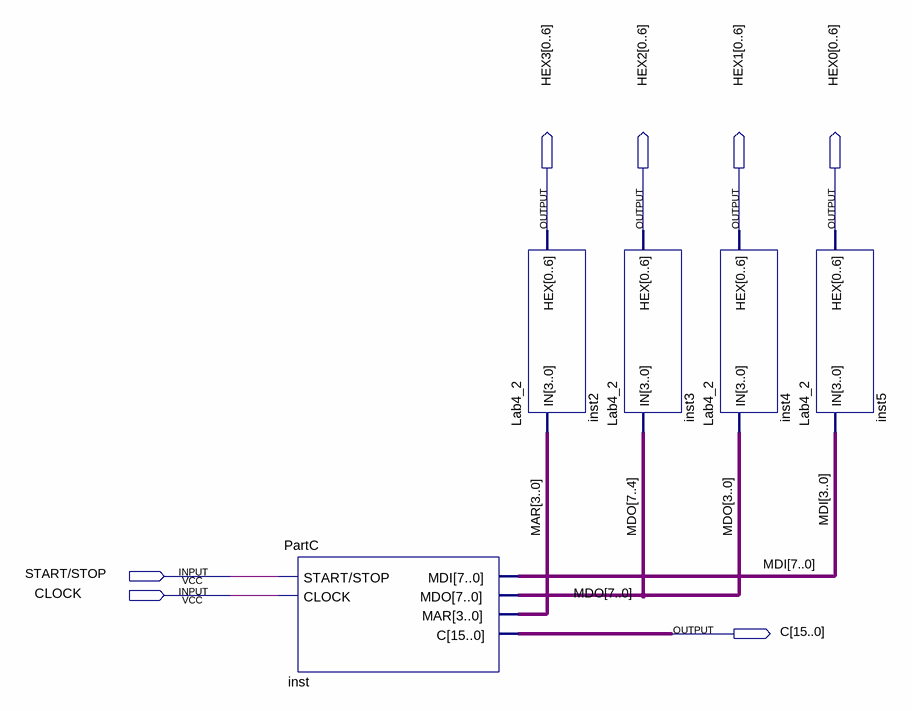
[diagram p0: schematic sheet]
// Quartus schematic TRISC_Pres.bdf as structural Verilog: 5 symbols, 7 pins
module TRISC_Pres (
  input  \START/STOP ,
  input  CLOCK,
  output [0:6] HEX3,
  output [0:6] HEX2,
  output [0:6] HEX1,
  output [0:6] HEX0,
  output [15:0] C
);

  wire [3:0] MAR;
  wire [7:0] MDI, MDO;

  PartC inst (.\START/STOP (\START/STOP ), .CLOCK(CLOCK), .MDI(MDI), .MDO(MDO), .MAR(MAR), .C(C));
  Lab4_2 inst2 (.IN(MAR), .HEX(HEX3));
  Lab4_2 inst3 (.IN(MDO[7:4]), .HEX(HEX2));
  Lab4_2 inst4 (.IN(MDO[3:0]), .HEX(HEX1));
  Lab4_2 inst5 (.IN(MDI[3:0]), .HEX(HEX0));
endmodule
